# EasyEDA Pro project DC_MotorDriver.eprj

# Schematic Schematic1
Board Name: Board1; Create Date: 2025-07-01; Page Name: P1; Project Name: DC_MotorDriver; Schematic Name: Schematic1; Update Date: 2025-07-02; Company: EasyEDA.com; Page Size: A4; Version: V1.0
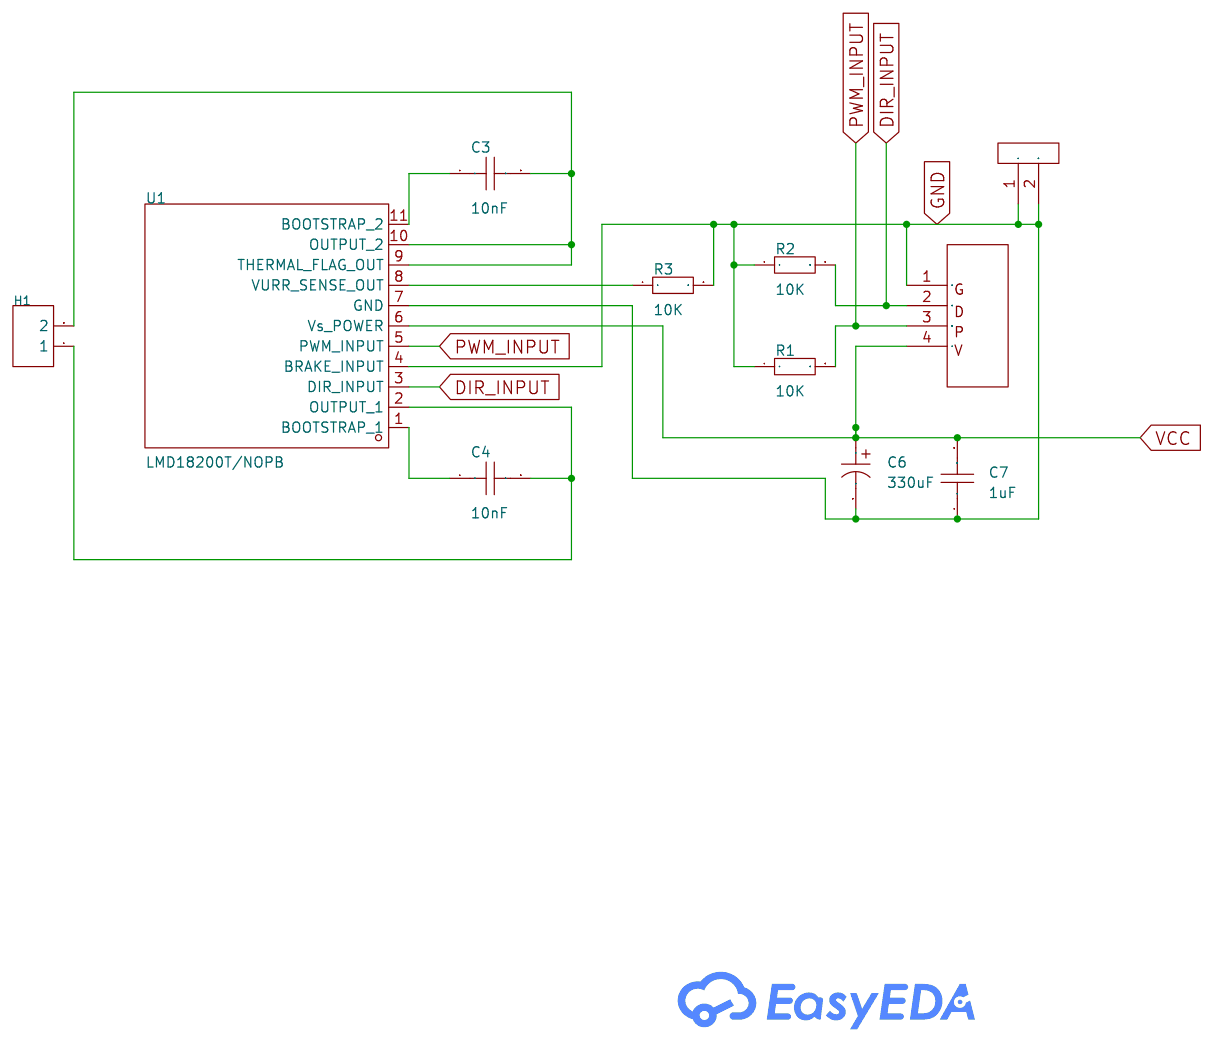
[diagram p0: schematic sheet]

## Parts
C3  10nF  [CAP-TH_L5.8-W2.8]
C4  10nF  [CAP-TH_L5.8-W2.8]
C6  330uF  [CAP-TH_BD10.0-P5.00-D0.6-FD_2]
C7  1uF  [CAP-TH_L5.8-W2.8]
H1  -  [HDR-TH_2P-P2.54-V-F]
R1  10K  [R0603]
R2  10K  [R0603]
R3  10K  [R0603]
U1  LMD18200T/NOPB  [TO-220-11_L20.0-W4.5-P1.70-BL]
U2  MDriver  [DC_Main_to_Motordriver_Connector_L]
U3  -  [Heatsink]

## Library data of the parts
C3 C4 C7 = CC1H104MC1FD3F6C10SA: LCSC Part Name: 100nF ±20% 50V; Supplier Part: C5375966; Manufacturer: Dersonic(德尔创); Supplier Footprint: 插件,P=5.08mm; JLCPCB Part Class: Extended Part; Datasheet: https://atta.szlcsc.com/upload/public/pdf/source/20230316/093632C311E32BFBDD3ED95C3153A3F7.pdf; Supplier: LCSC; Tolerance: ±20%; Voltage Rating: 50V; Pin Spacing: 5.08mm; Temperature Coefficient: Y5V; Diameter: 5.8mm; Body Thickness: 2.4mm
C6 = 1011001013R00: LCSC Part Name: 100uF ±20% 100V; Supplier Part: C2887236; Manufacturer: NJCON(永立); Supplier Footprint: 插件,D10xL12mm; JLCPCB Part Class: Extended Part; Datasheet: https://atta.szlcsc.com/upload/public/pdf/source/20210902/84CE7E45D44660992A8A41ADB32108B0.pdf; Supplier: LCSC; Tolerance: ±20%; Operating Temperature: -55℃~+105℃
H1 = HDR-F_2.54_1x2P: Supplier Footprint: Through
R1-R3 = Res_0603: Supplier Footprint: 0603
U1 = LMD18200T/NOPB: LCSC Part Name: 3A 有刷直流电机驱动芯片 55V; Supplier Part: C117011; Manufacturer: TI(德州仪器); Supplier Footprint: TO-220-11(Forming); JLCPCB Part Class: Extended Part; Datasheet: https://www.ti.com/cn/lit/gpn/lmd18200; Supplier: LCSC; Technology: Yes; Voltage - Supply: 9V~55V; Output Current: 3A; RDS(on): 660mΩ; Operating Temperature: -40℃~+125℃
U2 = DC_Main_to_Motordriver_Connector
U3 = Heatsink

## Nets
GND: C6.2 C7.1 R1.1 R2.1 R3.2 U1.4(BRAKE_INPUT) U1.7(GND) U2.1 U3.1 U3.2
VCC: C6.1 C7.2 U1.6(Vs_POWER) U2.4
DIR_INPUT: R2.2 U1.3(DIR_INPUT) U2.2
PWM_INPUT: R1.2 U1.5(PWM_INPUT) U2.3
$1N777: C3.2 H1.2 U1.9(THERMAL_FLAG_OUT) U1.10(OUTPUT_2)
$1N792: C4.2 H1.1 U1.2(OUTPUT_1)
$1N850: R3.1 U1.8(VURR_SENSE_OUT)
$1N1591: C3.1 U1.11(BOOTSTRAP_2)
$1N1612: C4.1 U1.1(BOOTSTRAP)

# Board PCB1
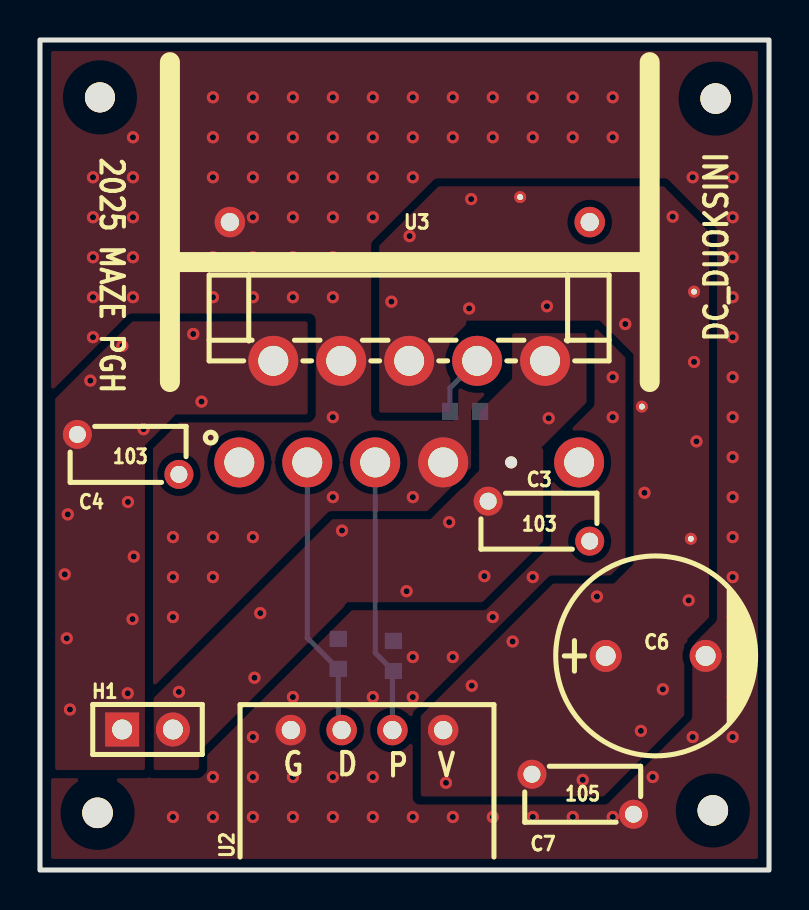
[diagram p1: board, top side]
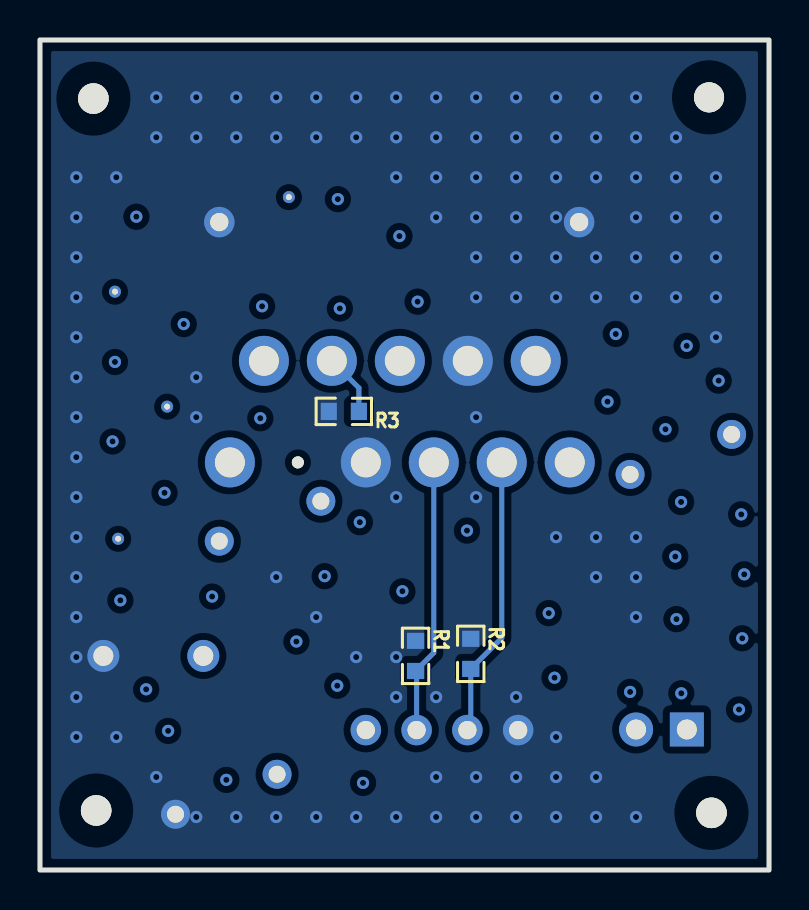
[diagram p2: board, bottom side, seen from below]

Outline 36.47 x 41.52 mm; copper layers: Top Layer, Inner1, Inner2, Bottom Layer. Coordinates in mm from the lower left corner of the outline.
Outline path: rectangle 0,41.52 36.47,0
Stack: Top Layer 0.035mm Outer layer thickness 1oz / Dielectric1 0.2104mm 7628 RC49% 8.6mil / Inner1 0.0152mm Inner layer thickness / Dielectric2 1.065mm 1.1mm H/HOZ Copper / Inner2 0.0152mm Inner layer thickness / Dielectric3 0.2104mm 7628 RC49% 8.6mil / Bottom Layer 0.035mm Outer layer thickness 1oz

## Design rules (mm)
template: Custom Config
spacing copperThickness1oz (default): track to track 0.102, other pairs 0.152 to 0.3
spacing copperThickness2oz: track to track 0.203, other pairs 0.152 to 0.3
track width copperThickness1oz (default): min 0.127, default 0.254, max 2.54
track width copperThickness2oz: min 0.203, default 0.254, max 2.54
differential pair differentialPair (default): width min 0.127, default 0.254, max 2.54; gap min 0.152, default 0.152
via viaSize (default): diameter min 0.5, default 0.61, max 10; hole min 0.3, default 0.305, max 6.3

## Placement (name value [footprint] x y rotation side)
C3  10nF  [CAP-TH_L5.8-W2.8]  24.96 17.45 180 top
C4  10nF  [CAP-TH_L5.8-W2.8]  4.41 20.79 180 top
C6  330uF  [CAP-TH_BD10.0-P5.00-D0.6-FD_2]  30.8 10.71 0 top
C7  1uF  [CAP-TH_L5.8-W2.8]  27.15 3.79 180 top
H1  -  [HDR-TH_2P-P2.54-V-F]  5.38 7.03 0 top
NOREF  -  [Pad_e97]  32.72 28.93 0 top
NOREF#2  -  [Pad_e19]  3 38.65 0 top
NOREF#3  -  [Pad_e20]  2.88 2.86 0 top
NOREF#4  -  [Pad_e98]  30.11 23.18 0 top
NOREF#5  -  [Pad_e96]  24.02 33.66 0 top
NOREF#6  -  [Pad_e22]  33.8 38.59 0 top
NOREF#7  -  [Pad_e21]  33.66 2.98 0 top
NOREF#8  -  [Pad_e99]  32.56 16.57 0 top
R1  10K  [R0603]  17.68 10.71 270 bottom
R2  10K  [R0603]  14.92 10.81 270 bottom
R3  10K  [R0603]  21.27 22.94 0 bottom
U1  LMD18200T/NOPB  [TO-220-11_L20.0-W4.5-P1.70-BL]  18.47 22.93 0 top
U2  MDriver  [DC_Main_to_Motordriver_Connector_L]  16.36 4.46 90 top
U3  -  [Heatsink]  18.5 32.41 0 top

## Footprints (pads in the part's own frame, mm; a bottom-side part is the same pattern mirrored in y, then rotated)
CAP-TH_BD10.0-P5.00-D0.6-FD_2
  round 1.6 hole 1: 1(-2.5,0) 2(2.5,0)
CAP-TH_L5.8-W2.8
  round 1.45 hole 0.85: 1(-2.54,1) 2(2.54,-1)
DC_Main_to_Motordriver_Connector_L
  round 1.524 hole 0.914: 1(2.54,3.81) 2(2.54,1.27) 3(2.54,-1.27) 4(2.54,-3.81)
HDR-TH_2P-P2.54-V-F
  rect 1.7x1.7 hole 1: 1(-1.27,0)
  round 1.7 hole 1: 2(1.27,0)
Heatsink
  round 1.524 hole 0.914: 1(-9,0) 2(9,0)
Pad_e19
  round 1.5 hole 3: 1(0,0)
Pad_e20
  round 1.524 hole 3: 2(0,0)
Pad_e21
  round 1.524 hole 3: 3(0,0)
Pad_e22
  round 1.524 hole 3: 4(0,0)
Pad_e96
  round 0.6 hole 0.3: 1(0,0)
Pad_e97
  round 0.6 hole 0.3: 2(0,0)
Pad_e98
  round 0.6 hole 0.3: 3(0,0)
Pad_e99
  round 0.6 hole 0.3: 4(0,0)
R0603
  rect 0.806x0.864 smd: 1(-0.753,0) 2(0.753,0)
TO-220-11_L20.0-W4.5-P1.70-BL
  round 2.5 hole 1.5: 1(-8.501,-2.54) 2(-6.799,2.54) 3(-5.1,-2.54) 4(-3.401,2.54) 5(-1.7,-2.54) 6(-0.001,2.54) 7(1.7,-2.54) 8(3.401,2.54) 10(6.799,2.54) 11(8.501,-2.54)
  round 0.6 hole 3x0.3: 9(5.1,-2.54)

## Nets
As in the schematic, except:
VCC: C6.1 C7.2 NOREF.2 NOREF#4.3 NOREF#5.1 NOREF#8.4 U1.6 U2.4

Pads without a net: NOREF#2 1; NOREF#3 2; NOREF#6 4; NOREF#7 3

## Via types
v1: diameter 0.61, hole 0.305, Top Layer to Bottom Layer, 151 vias

## Routing (per net, layer and track width the routed paths; a pad name or vN(x,y) marks a point on that pad's centre or on a via; arc(x,y) is an arc through that point)
GND:
  vias: v1(2.65,34.65) v1(2.65,32.65) v1(2.65,30.65) v1(2.65,28.65) v1(2.65,26.65) v1(4.65,36.65) v1(4.65,34.65) v1(4.65,32.65) v1(4.65,30.65) v1(4.65,28.65) v1(6.65,38.65) v1(6.65,36.65) v1(6.65,34.65) v1(6.65,32.65) v1(6.65,30.65) v1(6.65,28.65) v1(6.65,16.65) v1(6.65,14.65) v1(6.65,12.65) v1(6.65,2.65) v1(8.65,38.65) v1(8.65,36.65) v1(8.65,34.65) v1(8.65,30.65) v1(8.65,28.65) v1(8.65,16.65) v1(8.65,14.65) v1(8.65,4.65) v1(8.65,2.65) v1(10.65,38.65) v1(10.65,36.65) v1(10.65,34.65) v1(10.65,32.65) v1(10.65,30.65) v1(10.65,28.65) v1(10.65,16.65) v1(10.65,6.65) v1(10.65,4.65) v1(10.65,2.65) v1(12.65,38.65) v1(12.65,36.65) v1(12.65,34.65) v1(12.65,32.65) v1(12.65,30.65) v1(12.65,28.65) v1(12.65,8.65) v1(12.65,4.65) v1(12.65,2.65) v1(14.65,38.65) v1(14.65,36.65) v1(14.65,34.65) v1(14.65,32.65) v1(14.65,30.65) v1(14.65,28.65) v1(14.65,22.65) v1(14.65,18.65) v1(14.65,4.65) v1(14.65,2.65) v1(16.65,38.65) v1(16.65,36.65) v1(16.65,34.65) v1(16.65,32.65) v1(16.65,8.65) v1(16.65,4.65) v1(16.65,2.65) v1(18.65,38.65) v1(18.65,36.65) v1(18.65,34.65) v1(18.65,18.65) v1(18.65,10.65) v1(18.65,8.65) v1(18.65,2.65) v1(20.65,38.65) v1(20.65,36.65) v1(20.65,10.65) v1(20.65,2.65) v1(22.65,38.65) v1(22.65,36.65) v1(22.65,12.65) v1(22.65,2.65) v1(24.65,38.65) v1(24.65,36.65) v1(24.65,14.65) v1(24.65,2.65) v1(26.65,38.65) v1(26.65,36.65) v1(26.65,2.65) v1(28.65,38.65) v1(28.65,36.65) v1(28.65,24.65) v1(28.65,22.65) v1(28.65,2.65) v1(30.65,38.65) v1(30.65,36.65) v1(30.65,4.65) v1(32.65,34.65) v1(32.65,6.65) v1(34.65,34.65) v1(34.65,32.65) v1(34.65,30.65) v1(34.65,28.65) v1(34.65,26.65) v1(34.65,24.65) v1(34.65,22.65) v1(34.65,20.65) v1(34.65,18.65) v1(34.65,16.65) v1(34.65,14.65) v1(34.65,12.65) v1(34.65,10.65) v1(34.65,8.65) v1(34.65,6.65)
VCC:
  vias: v1(17.58,28.43) v1(18.49,31.71) v1(20.31,4.36) v1(21.47,28.09) v1(21.57,33.56) v1(21.6,9.22) v1(23.64,11.43) v1(25.36,28.2) v1(27.15,4.51) v1(27.86,13.68) v1(29.28,27.31) v1(30.06,6.96) v1(30.24,18.87) v1(31.16,9.04) v1(31.65,32.68) v1(32.45,13.49) v1(32.72,25.42) v1(32.84,21.44)
DIR_INPUT: length 14.1
  Bottom Layer w0.254: U1.3 13.37,11.61 R2.2 14.92,7.17 U2.2
PWM_INPUT: length 13.8
  Bottom Layer w0.254: U1.5 16.77,10.87 R1.2 17.63,9.91 U2.3
$1N777:
  vias: v1(6.95,8.91) v1(10.73,9.62) v1(11.02,12.85) v1(15.11,16.98) v1(18.34,13.95) v1(20.47,17.4) v1(22.23,14.7) v1(25.45,22.6)
$1N792:
  vias: v1(1.24,14.79) v1(1.34,11.59) v1(1.39,17.79) v1(1.5,8.03) v1(2.52,24.48) v1(4.12,26.22) v1(4.4,18.41) v1(4.39,8.84) v1(4.63,12.55) v1(4.69,15.68) v1(5.18,22.05) v1(7.67,26.81) v1(8.08,23.43)
$1N850: length 3.1
  Bottom Layer w0.254: U1.8 20.52,24.12 R3.1

## Copper pours and planes (outline as drawn; the poured copper is in the pictures)
GND on Top Layer: -3.38,45.65 48.11,45.65 48.11,-0.62 44.78,-3.95 -9.5,-3.95 -10.39,-4.84 -10.39,38.64
GND on Bottom Layer: -1.05,43.49 36.84,43.49 37.51,42.82 37.51,-1.6 37.65,-1.74 -0.17,-1.74 -1.13,-0.78 -1.13,43.41
GND on Inner1: -1.14,43.16 -0.84,42.86 38.38,42.86 38.38,-2.07 38.08,-2.37 -1.44,-2.37 -1.59,-2.22 -1.59,42.71
GND on Inner2: -3.6,45.51 38.23,45.51 38.89,44.85 38.89,-3.5 -4.63,-3.5 -7.08,-1.05 -7.08,42.03
VCC on Top Layer: 16.96,22.83 20.57,22.83 20.58,22.82 20.58,26.34 20.51,26.41 21.37,27.27 21.37,27.43 27.99,27.43 29.64,25.78 29.64,15.33 28.69,14.38 25.65,14.38 19.02,7.75 19,7.75 19,3.63 28.22,3.63 32.28,7.72 32.28,11.25 32.44,11.41 32.44,11.54 33.52,12.62 33.52,31.94 31.22,34.25 19.92,34.25 16.92,31.25 16.92,22.87
VCC on Inner1: 20.12,22.76 20.25,22.89 20.25,26.51 21.14,27.4 27.87,27.4 29.45,25.82 29.45,15.58 28.41,14.54 25.42,14.54 18.74,7.86 18.74,3.71 28.04,3.71 32.18,7.85 32.18,11.55 33.43,12.8 33.43,31.91 30.95,34.39 19.74,34.39 16.79,31.44 16.79,22.76
VCC on Inner1: 5.49,25.24 4.92,25.81 5.49,26.37 6.05,25.81
$1N777 on Top Layer: 23.57,26.9 23.57,24.59 21.92,22.94 21.92,20 19.52,17.6 14.61,17.6 5.71,8.7 5.64,8.7 5.64,5.11 5.61,5.08 5.64,5.05 5.64,4.95 7.88,4.95 8.01,5.08 8.01,5.9 15.3,13.19 15.3,13.25 15.4,13.35 22.15,13.35 25.22,16.42 25.22,21.06 25.15,21.13 27.39,23.37 27.39,26.9 23.57,26.9
$1N777 on Inner1: 23.62,27.02 23.62,24.51 21.97,22.86 21.97,20.01 19.56,17.6 14.69,17.6 5.4,8.31 5.4,4.94 7.87,4.94 7.96,5.03 7.96,5.76 15.42,13.22 22.09,13.22 25.25,16.38 25.25,21.22 27.46,23.43 27.46,27.02
$1N792 on Top Layer: 13.44,27.49 4.6,27.49 0.71,23.6 0.71,5.01 0.65,4.95 5.27,4.95 5.3,4.98 5.3,21.23 6.81,22.74 13.37,22.74 13.44,22.81
$1N792 on Inner1: 13.43,27.49 4.5,27.49 0.66,23.55 0.66,4.94 0.56,4.84 5.22,4.84 5.32,4.94 5.32,21.17 5.28,21.21 6.83,22.76 13.43,22.76 13.43,27.49
$1N1591 on Inner1: 28.64,22.24 26.4,22.24 25.51,21.35 25.51,15.18 25.53,15.02 28.61,15.02 28.64,15.05
$1N1612 on Inner1: 11.47,22.5 7.01,22.5 5.61,21.1 5.6,21.1 5.6,18.57 5.61,18.56 11.44,18.56 11.45,18.55 11.47,18.57

## Text on the board
Top Silkscreen Layer: 105 | 103 | G | D | P | V | 2025 MAZE PGH | DC_DUOKSINI
